# Altium project x-IMU3-SA-IMU.PrjPcb
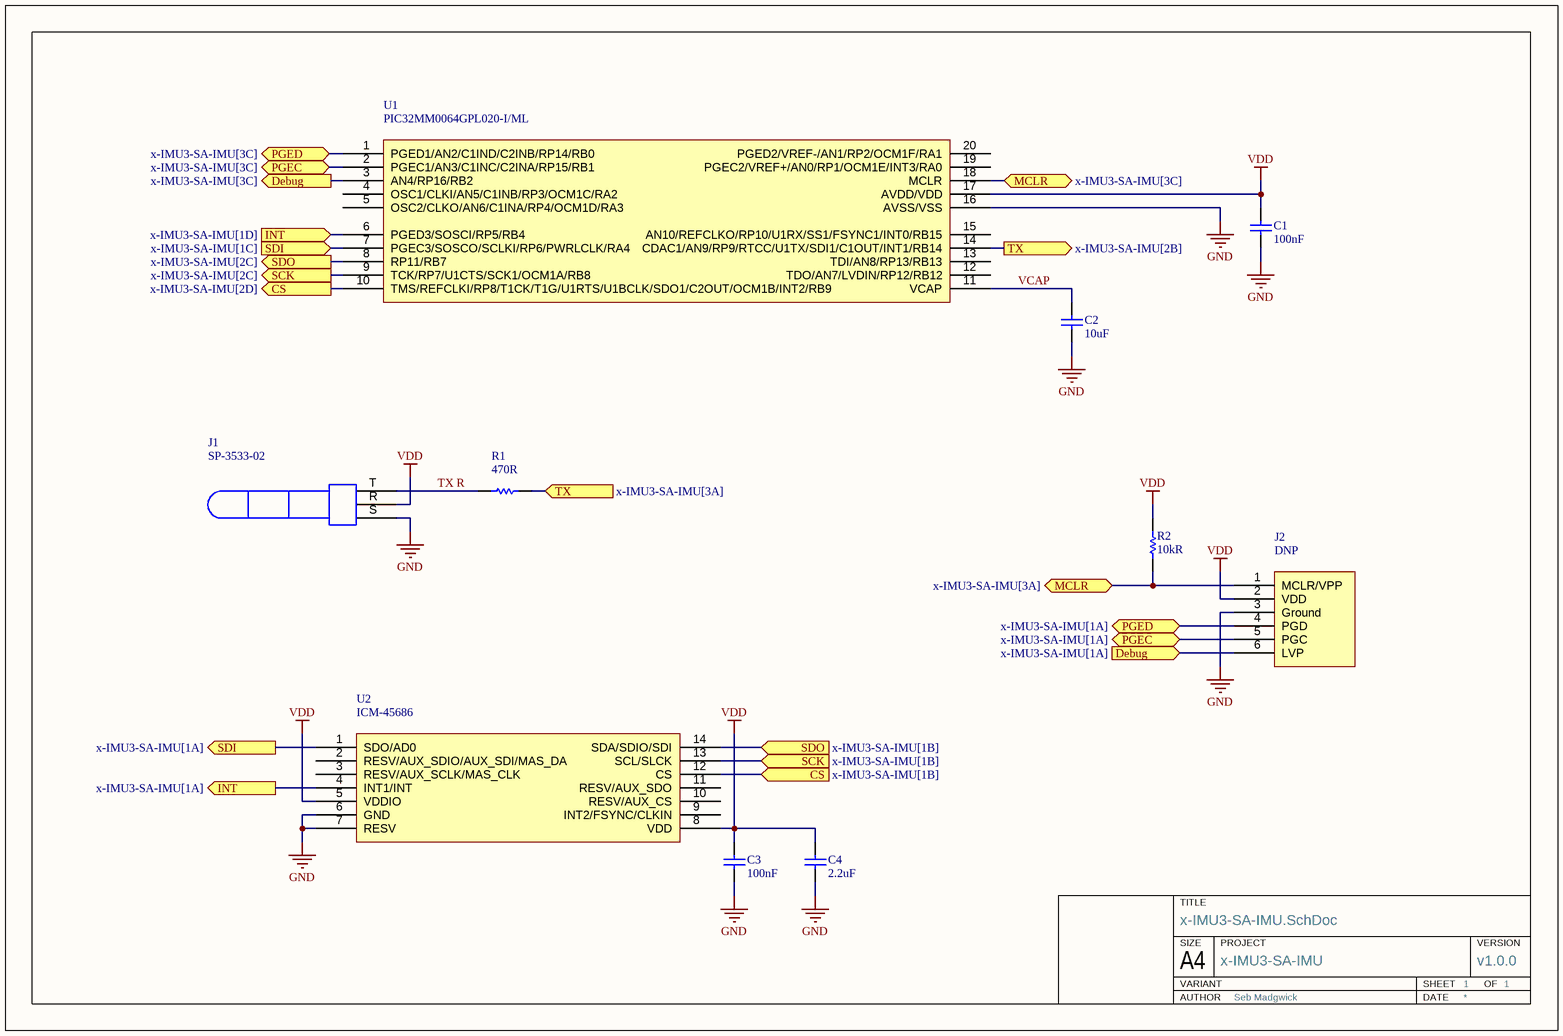
[diagram p0: x-IMU3-SA-IMU.SchDoc]
Author: Seb Madgwick; Project: x-IMU3-SA-IMU; Version: v1.0.0
1 sheet, 10 parts. Net scope: flat (ports and power ports of the same name join across sheets).
Board file: x-IMU3-SA-IMU.PcbDoc

## Sheet x-IMU3-SA-IMU.SchDoc
size A4; SheetNumber: 1; SheetTotal: 1

### Parts
C1  100nF  [Capacitor 0402]
C2  10uF  [Capacitor 0402]
C3  100nF  [Capacitor 0402]
C4  2.2uF  [Capacitor 0402]
J1  SP-3533-02  [SP-3533-02]
J2  DNP  [Tag Connect No Legs]
R1  470R  [Resistor 0402]
R2  10kR  [Resistor 0402]
U1  PIC32MM0064GPL020-I/ML  [QFN-20]
U2  ICM-45686  [ICM-45686]

### Ports
CS (in, see x-IMU3-SA-IMU[1B]), CS (out, see x-IMU3-SA-IMU[2D]), Debug (in, see x-IMU3-SA-IMU[1A]), Debug (out, see x-IMU3-SA-IMU[3C]), INT (in, see x-IMU3-SA-IMU[1D]), INT (out, see x-IMU3-SA-IMU[1A]), MCLR (bidir, see x-IMU3-SA-IMU[3A]), MCLR (bidir, see x-IMU3-SA-IMU[3C]), PGEC (bidir, see x-IMU3-SA-IMU[1A]), PGEC (bidir, see x-IMU3-SA-IMU[3C]), PGED (bidir, see x-IMU3-SA-IMU[1A]), PGED (bidir, see x-IMU3-SA-IMU[3C]), SCK (in, see x-IMU3-SA-IMU[1B]), SCK (out, see x-IMU3-SA-IMU[2C]), SDI (in, see x-IMU3-SA-IMU[1C]), SDI (out, see x-IMU3-SA-IMU[1A]), SDO (in, see x-IMU3-SA-IMU[1B]), SDO (out, see x-IMU3-SA-IMU[2C]), TX (in, see x-IMU3-SA-IMU[3A]), TX (out, see x-IMU3-SA-IMU[2B])

### Nets
GND: C1.1 C2.1 C3.1 C4.1 J1.S J2.3(Ground) U1.16(AVSS/VSS) U2.6(GND) U2.7(RESV)
VDD: C1.2 C3.2 C4.2 J1.R J2.2(VDD) R2.2 U1.17(AVDD/VDD) U2.5(VDDIO) U2.8(VDD)
CS: U1.10(TMS/REFCLKI/RP8/T1CK/T1G/U1RTS/U1BCLK/SDO1/C2OUT/OCM1B/INT2/RB9) U2.12(CS) ; port CS
Debug: J2.6(LVP) U1.3(AN4/RP16/RB2) ; port Debug
INT: U1.6(PGED3/SOSCI/RP5/RB4) U2.4(INT1/INT) ; port INT
MCLR: J2.1(MCLR/VPP) R2.1 U1.18(MCLR) ; port MCLR
PGEC: J2.5(PGC) U1.2(PGEC1/AN3/C1INC/C2INA/RP15/RB1) ; port PGEC
PGED: J2.4(PGD) U1.1(PGED1/AN2/C1IND/C2INB/RP14/RB0) ; port PGED
SCK: U1.9(TCK/RP7/U1CTS/SCK1/OCM1A/RB8) U2.13(SCL/SLCK) ; port SCK
SDI: U1.7(PGEC3/SOSCO/SCLKI/RP6/PWRLCLK/RA4) U2.1(SDO/AD0) ; port SDI
SDO: U1.8(RP11/RB7) U2.14(SDA/SDIO/SDI) ; port SDO
TX: R1.2 U1.14(CDAC1/AN9/RP9/RTCC/U1TX/SDI1/C1OUT/INT1/RB14) ; port TX
TX R: J1.T R1.1
VCAP: C2.2 U1.11(VCAP)

Not connected (* = marked no-connect by the designer): U1 4(OSC1/CLKI/AN5/C1INB/RP3/OCM1C/RA2) 5(OSC2/CLKO/AN6/C1INA/RP4/OCM1D/RA3) 12(TDO/AN7/LVDIN/RP12/RB12) 13(TDI/AN8/RP13/RB13) 15(AN10/REFCLKO/RP10/U1RX/SS1/FSYNC1/INT0/RB15) 19(PGEC2/VREF+/AN0/RP1/OCM1E/INT3/RA0) 20(PGED2/VREF-/AN1/RP2/OCM1F/RA1); U2 2(RESV/AUX_SDIO/AUX_SDI/MAS_DA) 3(RESV/AUX_SCLK/MAS_CLK) 9(INT2/FSYNC/CLKIN) 10(RESV/AUX_CS) 11(RESV/AUX_SDO)

### Notes on the sheet
- TITLE
- SIZE
- A4
- VARIANT
- PROJECT
- SHEET
- VERSION
- OF
- AUTHOR
- DATE

### Library data of the parts
C1-C4 = Capacitor
J2 = MPLAB ICSP
R1 R2 = Resistor